# Altium schematic sheet DDR3.SchDoc: DDR3 memory
size 420 x 297 mm; CheckedBy: T.Janicki; CompanyName: Creotech Instruments SA; DrawnBy: G.Kasprowicz; Organization: CERN; Address1: European Organization for Nuclear Research; Address2: CH-1211 Genève 23 - Switzerland; Revision: -; SheetNumber: 3; SheetTotal: 19; EDA_Number: EDA-xxxx; Projet: Simple VME FMC Carrier; ModifiedBy: -; CreateDate: 20/11/2012; CheckedDate: 23/01/2012; Title2: - bank 4 -; DivGrp: BE-CO; Designer: G.Kasprowicz; PageSetup: Record=PageOptions|CenterHorizontal=True|CenterVertical=True|PrintScale=0.95|XCorrection=1.00|YCorrection=1.00|PrintKind=1|BorderSize=5000000|LeftOffset=0|BottomOffset=0|Orientation=2|PaperLength=1000|PaperWidth=1000|Scale=100|PaperSource=15|PrintQuality=600|MediaType=1|DitherType=10|PaperKind=A3|PrintScaleMode=1; ModifiedDate: -
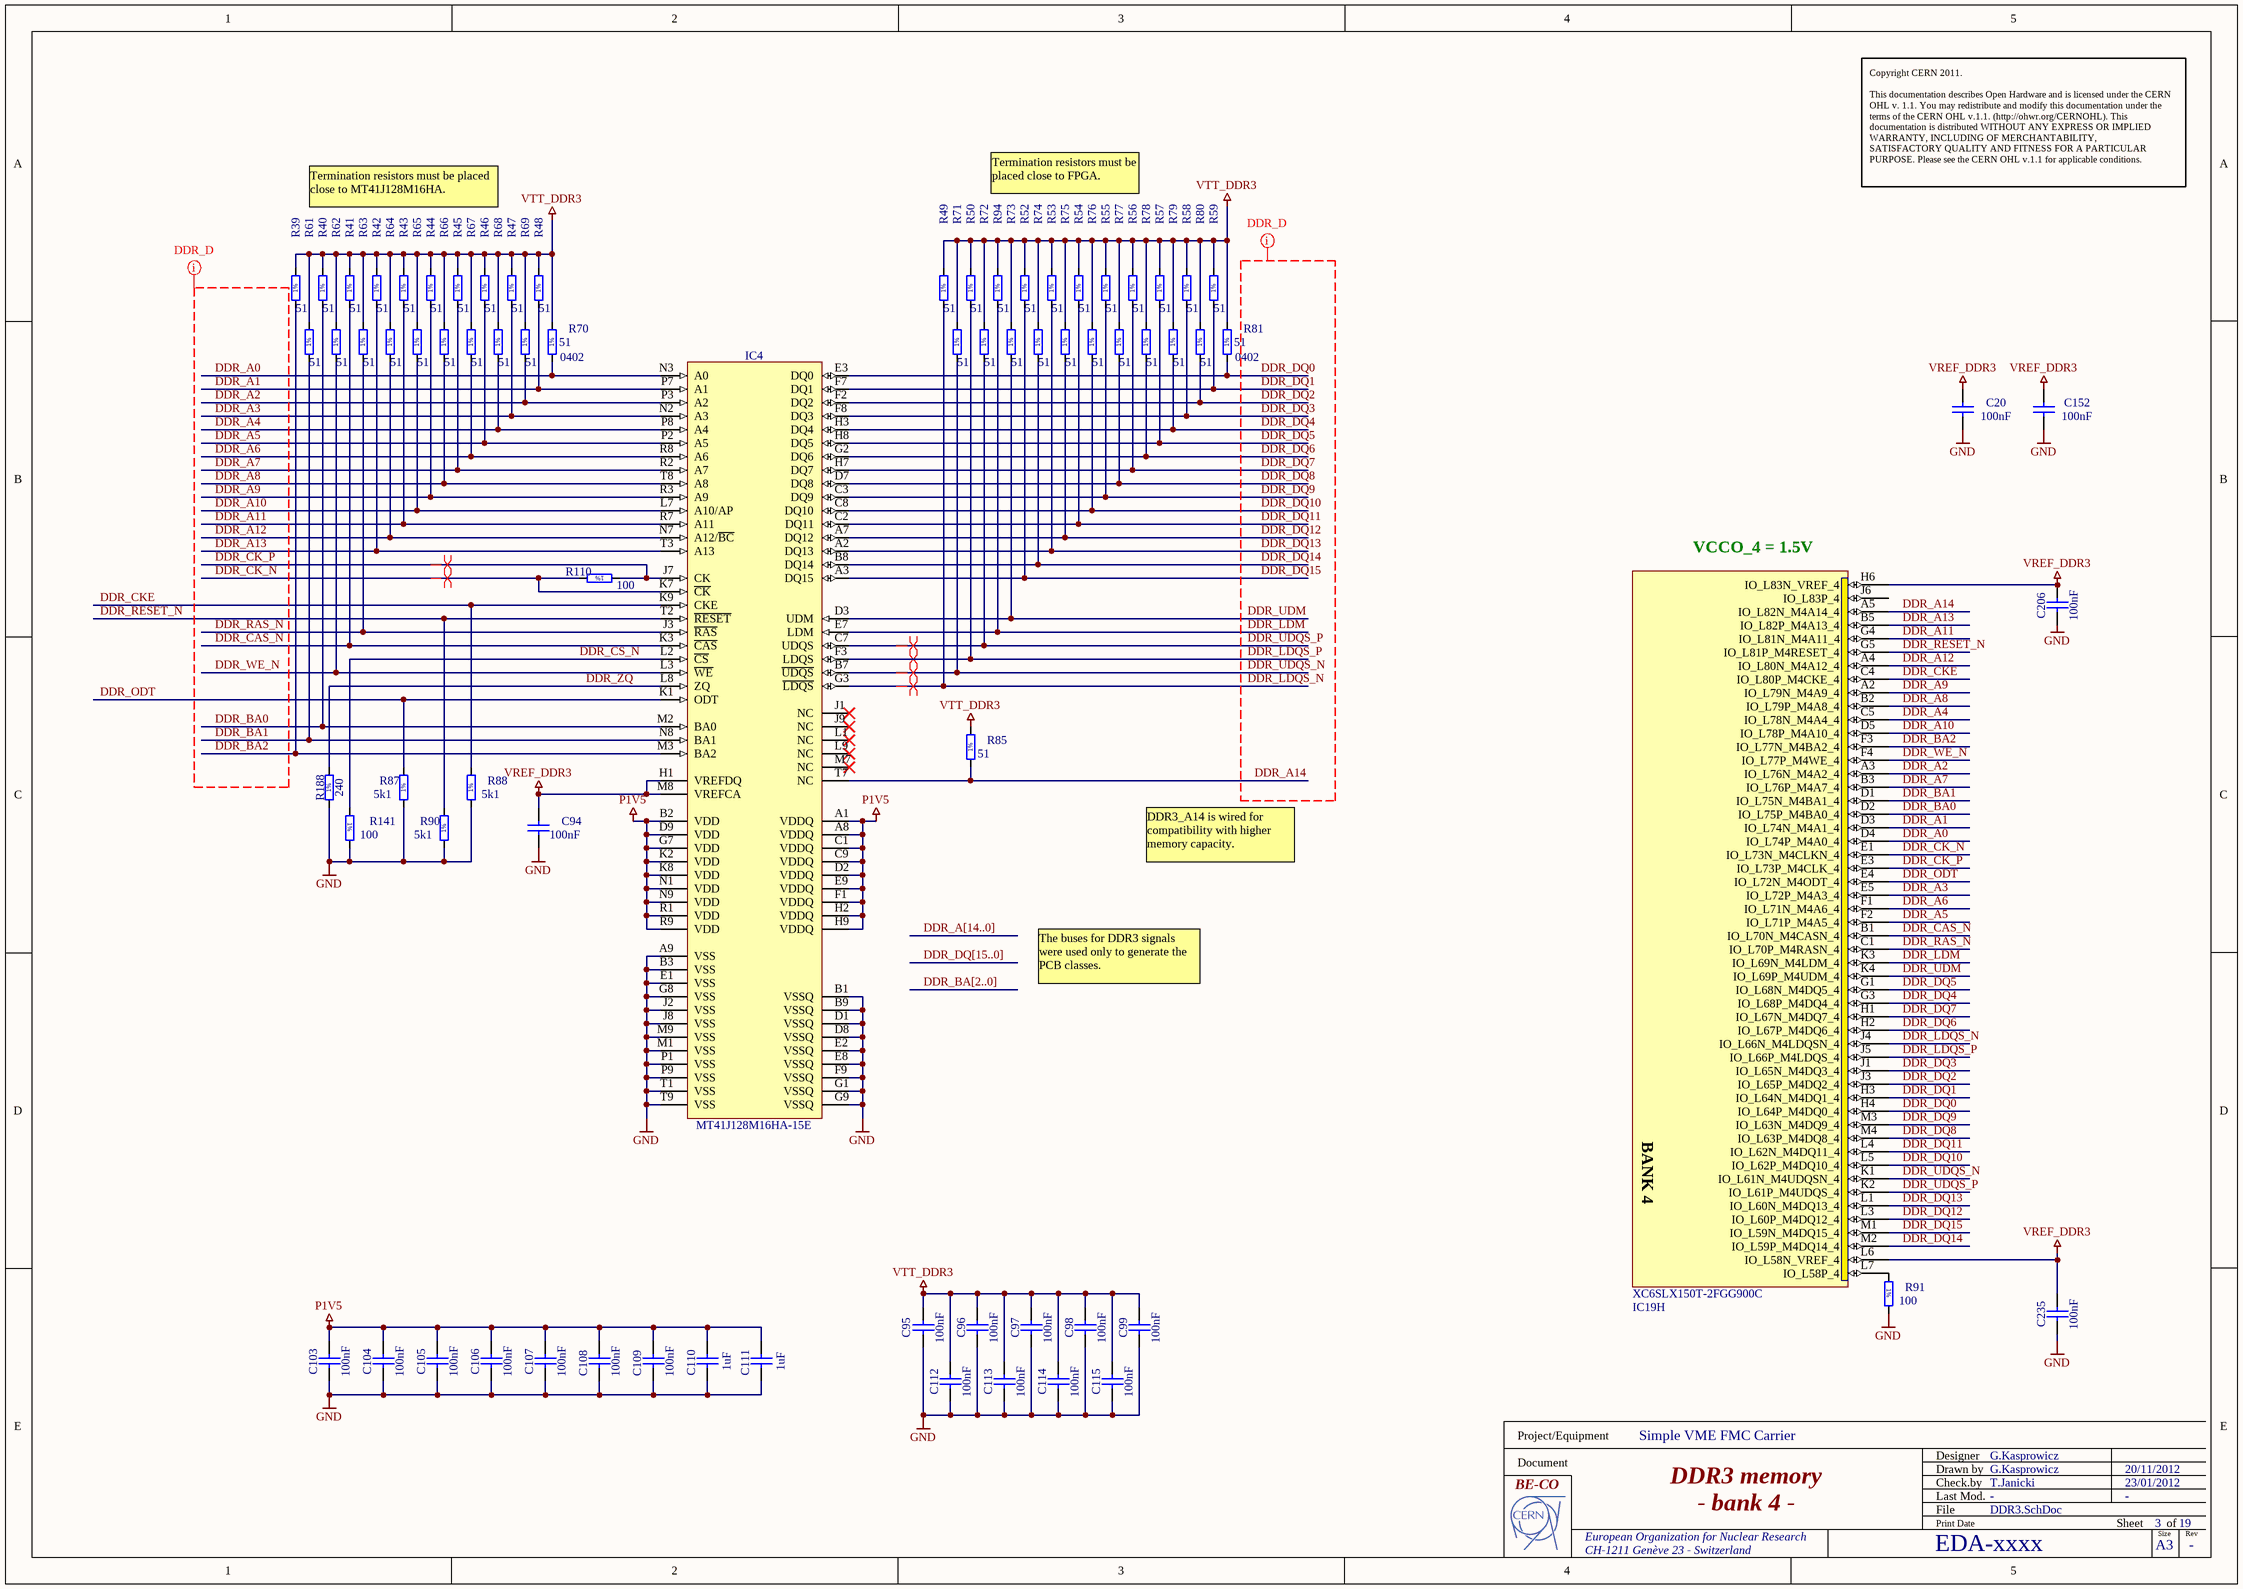
[diagram p0: DDR3.SchDoc]

## Parts
C20  100nF  [CAPC1005X55N]
C94  100nF  [CAPC1005X55N]
C95  100nF  [CAPC1005X55N]
C96  100nF  [CAPC1005X55N]
C97  100nF  [CAPC1005X55N]
C98  100nF  [CAPC1005X55N]
C99  100nF  [CAPC1005X55N]
C103  100nF  [CAPC1005X55N]
C104  100nF  [CAPC1005X55N]
C105  100nF  [CAPC1005X55N]
C106  100nF  [CAPC1005X55N]
C107  100nF  [CAPC1005X55N]
C108  100nF  [CAPC1005X55N]
C109  100nF  [CAPC1005X55N]
C110  1uF  [CAPC1608X87N]
C111  1uF  [CAPC1608X87N]
C112  100nF  [CAPC1005X55N]
C113  100nF  [CAPC1005X55N]
C114  100nF  [CAPC1005X55N]
C115  100nF  [CAPC1005X55N]
C152  100nF  [CAPC1005X55N]
C206  100nF  [CAPC1005X55N]
C235  100nF  [CAPC1005X55N]
IC4  MT41J128M16HA-15E  [BGA96C80P9X16_900X1400X120]
IC19  XC6SLX150T-2FGG900C  [BGA900C100P30X30_3100X3100X260]  (part H of 18)
R39  51  [RESC1005X40N]
R40  51  [RESC1005X40N]
R41  51  [RESC1005X40N]
R42  51  [RESC1005X40N]
R43  51  [RESC1005X40N]
R44  51  [RESC1005X40N]
R45  51  [RESC1005X40N]
R46  51  [RESC1005X40N]
R47  51  [RESC1005X40N]
R48  51  [RESC1005X40N]
R49  51  [RESC1005X40N]
R50  51  [RESC1005X40N]
R52  51  [RESC1005X40N]
R53  51  [RESC1005X40N]
R54  51  [RESC1005X40N]
R55  51  [RESC1005X40N]
R56  51  [RESC1005X40N]
R57  51  [RESC1005X40N]
R58  51  [RESC1005X40N]
R59  51  [RESC1005X40N]
R61  51  [RESC1005X40N]
R62  51  [RESC1005X40N]
R63  51  [RESC1005X40N]
R64  51  [RESC1005X40N]
R65  51  [RESC1005X40N]
R66  51  [RESC1005X40N]
R67  51  [RESC1005X40N]
R68  51  [RESC1005X40N]
R69  51  [RESC1005X40N]
R70  51  Case: 0402  [RESC1005X40N]
R71  51  [RESC1005X40N]
R72  51  [RESC1005X40N]
R73  51  [RESC1005X40N]
R74  51  [RESC1005X40N]
R75  51  [RESC1005X40N]
R76  51  [RESC1005X40N]
R77  51  [RESC1005X40N]
R78  51  [RESC1005X40N]
R79  51  [RESC1005X40N]
R80  51  [RESC1005X40N]
R81  51  Case: 0402  [RESC1005X40N]
R85  51  [RESC1005X40N]
R87  5k1  [RESC1608X55N]
R88  5k1  [RESC1608X55N]
R90  5k1  [RESC1608X55N]
R91  100  [RESC1608X55N]
R94  51  [RESC1005X40N]
R110  100  [RESC1608X55N]
R141  100  [RESC1608X55N]
R188  240  [RESC1608X55N]

## Nets
GND: C20.1 C94.1 C95.1 C96.1 C97.1 C98.1 C99.1 C103.1 C104.1 C105.1 C106.1 C107.1 C108.1 C109.1 C110.1 C111.1 C112.1 C113.1 C114.1 C115.1 C152.1 C206.1 C235.1 IC4.A9(VSS) IC4.B1(VSSQ) IC4.B3(VSS) IC4.B9(VSSQ) IC4.D1(VSSQ) IC4.D8(VSSQ) IC4.E1(VSS) IC4.E2(VSSQ) IC4.E8(VSSQ) IC4.F9(VSSQ) IC4.G1(VSSQ) IC4.G8(VSS) IC4.G9(VSSQ) IC4.J2(VSS) IC4.J8(VSS) IC4.M1(VSS) IC4.M9(VSS) IC4.P1(VSS) IC4.P9(VSS) IC4.T1(VSS) IC4.T9(VSS) R87.1 R88.1 R90.1 R91.2 R141.2 R188.1
P1V5: C103.2 C104.2 C105.2 C106.2 C107.2 C108.2 C109.2 C110.2 C111.2 IC4.A1(VDDQ) IC4.A8(VDDQ) IC4.B2(VDD) IC4.C1(VDDQ) IC4.C9(VDDQ) IC4.D2(VDDQ) IC4.D9(VDD) IC4.E9(VDDQ) IC4.F1(VDDQ) IC4.G7(VDD) IC4.H2(VDDQ) IC4.H9(VDDQ) IC4.K2(VDD) IC4.K8(VDD) IC4.N1(VDD) IC4.N9(VDD) IC4.R1(VDD) IC4.R9(VDD)
VREF_DDR3: C20.2 C94.2 C152.2 C206.2 C235.2 IC4.H1(VREFDQ) IC4.M8(VREFCA) IC19.H6(IO_L83N_VREF_4) IC19.L6(IO_L58N_VREF_4)
VTT_DDR3: C95.2 C96.2 C97.2 C98.2 C99.2 C112.2 C113.2 C114.2 C115.2 R39.2 R40.2 R41.2 R42.2 R43.2 R44.2 R45.2 R46.2 R47.2 R48.2 R49.2 R50.2 R52.2 R53.2 R54.2 R55.2 R56.2 R57.2 R58.2 R59.2 R61.2 R62.2 R63.2 R64.2 R65.2 R66.2 R67.2 R68.2 R69.2 R70.2 R71.2 R72.2 R73.2 R74.2 R75.2 R76.2 R77.2 R78.2 R79.2 R80.2 R81.2 R85.2 R94.2
DDR_A0: IC4.N3(A0) IC19.D4(IO_L74P_M4A0_4) R70.1
DDR_A1: IC4.P7(A1) IC19.D3(IO_L74N_M4A1_4) R48.1
DDR_A2: IC4.P3(A2) IC19.A3(IO_L76N_M4A2_4) R69.1
DDR_A3: IC4.N2(A3) IC19.E5(IO_L72P_M4A3_4) R47.1
DDR_A4: IC4.P8(A4) IC19.C5(IO_L78N_M4A4_4) R68.1
DDR_A5: IC4.P2(A5) IC19.F2(IO_L71P_M4A5_4) R46.1
DDR_A6: IC4.R8(A6) IC19.F1(IO_L71N_M4A6_4) R67.1
DDR_A7: IC4.R2(A7) IC19.B3(IO_L76P_M4A7_4) R45.1
DDR_A8: IC4.T8(A8) IC19.B2(IO_L79P_M4A8_4) R66.1
DDR_A9: IC4.R3(A9) IC19.A2(IO_L79N_M4A9_4) R44.1
DDR_A10: IC4.L7(A10/AP) IC19.D5(IO_L78P_M4A10_4) R65.1
DDR_A11: IC4.R7(A11) IC19.G4(IO_L81N_M4A11_4) R43.1
DDR_A12: IC4.N7(A12/~{BC}) IC19.A4(IO_L80N_M4A12_4) R64.1
DDR_A13: IC4.T3(A13) IC19.B5(IO_L82P_M4A13_4) R42.1
DDR_A14: IC4.T7(NC) IC19.A5(IO_L82N_M4A14_4) R85.1
DDR_BA0: IC4.M2(BA0) IC19.D2(IO_L75P_M4BA0_4) R40.1
DDR_BA1: IC4.N8(BA1) IC19.D1(IO_L75N_M4BA1_4) R61.1
DDR_BA2: IC4.M3(BA2) IC19.F3(IO_L77N_M4BA2_4) R39.1
DDR_CAS_N: IC4.K3(~{CAS}) IC19.B1(IO_L70N_M4CASN_4) R41.1
DDR_CK_N: IC4.K7(~{CK}) IC19.E1(IO_L73N_M4CLKN_4) R110.2
DDR_CK_P: IC4.J7(CK) IC19.E3(IO_L73P_M4CLK_4) R110.1
DDR_CKE: IC4.K9(CKE) IC19.C4(IO_L80P_M4CKE_4) R88.2
DDR_CS_N: IC4.L2(~{CS}) R141.1
DDR_DQ0: IC4.E3(DQ0) IC19.H4(IO_L64P_M4DQ0_4) R81.1
DDR_DQ1: IC4.F7(DQ1) IC19.H3(IO_L64N_M4DQ1_4) R59.1
DDR_DQ2: IC4.F2(DQ2) IC19.J3(IO_L65P_M4DQ2_4) R80.1
DDR_DQ3: IC4.F8(DQ3) IC19.J1(IO_L65N_M4DQ3_4) R58.1
DDR_DQ4: IC4.H3(DQ4) IC19.G3(IO_L68P_M4DQ4_4) R79.1
DDR_DQ5: IC4.H8(DQ5) IC19.G1(IO_L68N_M4DQ5_4) R57.1
DDR_DQ6: IC4.G2(DQ6) IC19.H2(IO_L67P_M4DQ6_4) R78.1
DDR_DQ7: IC4.H7(DQ7) IC19.H1(IO_L67N_M4DQ7_4) R56.1
DDR_DQ8: IC4.D7(DQ8) IC19.M4(IO_L63P_M4DQ8_4) R77.1
DDR_DQ9: IC4.C3(DQ9) IC19.M3(IO_L63N_M4DQ9_4) R55.1
DDR_DQ10: IC4.C8(DQ10) IC19.L5(IO_L62P_M4DQ10_4) R76.1
DDR_DQ11: IC4.C2(DQ11) IC19.L4(IO_L62N_M4DQ11_4) R54.1
DDR_DQ12: IC4.A7(DQ12) IC19.L3(IO_L60P_M4DQ12_4) R75.1
DDR_DQ13: IC4.A2(DQ13) IC19.L1(IO_L60N_M4DQ13_4) R53.1
DDR_DQ14: IC4.B8(DQ14) IC19.M2(IO_L59P_M4DQ14_4) R74.1
DDR_DQ15: IC4.A3(DQ15) IC19.M1(IO_L59N_M4DQ15_4) R52.1
DDR_LDM: IC4.E7(LDM) IC19.K3(IO_L69N_M4LDM_4) R94.1
DDR_LDQS_N: IC4.G3(~{LDQS}) IC19.J4(IO_L66N_M4LDQSN_4) R49.1
DDR_LDQS_P: IC4.F3(LDQS) IC19.J5(IO_L66P_M4LDQS_4) R50.1
DDR_ODT: IC4.K1(ODT) IC19.E4(IO_L72N_M4ODT_4) R87.2
DDR_RAS_N: IC4.J3(~{RAS}) IC19.C1(IO_L70P_M4RASN_4) R63.1
DDR_RESET_N: IC4.T2(~{RESET}) IC19.G5(IO_L81P_M4RESET_4) R90.2
DDR_UDM: IC4.D3(UDM) IC19.K4(IO_L69P_M4UDM_4) R73.1
DDR_UDQS_N: IC4.B7(~{UDQS}) IC19.K1(IO_L61N_M4UDQSN_4) R71.1
DDR_UDQS_P: IC4.C7(UDQS) IC19.K2(IO_L61P_M4UDQS_4) R72.1
DDR_WE_N: IC4.L3(~{WE}) IC19.F4(IO_L77P_M4WE_4) R62.1
DDR_ZQ: IC4.L8(ZQ) R188.2
NetIC19_L7: IC19.L7(IO_L58P_4) R91.1

Not connected (* = marked no-connect by the designer): IC4 J1(NC)* J9(NC)* L1(NC)* L9(NC)* M7(NC)*; IC19 J6(IO_L83P_4)

## Buses and harness runs
bus DDR_A[14..0]
bus DDR_BA[2..0]
bus DDR_DQ[15..0]

## Layout directives
differential pair: DDR_CK_N, DDR_CK_P, DDR_LDQS_N, DDR_LDQS_P, DDR_UDQS_N, DDR_UDQS_P
net class DDR_D: DDR_A0, DDR_A1, DDR_A2, DDR_A3, DDR_A4, DDR_A5, DDR_A6, DDR_A7, DDR_A8, DDR_A9, DDR_A10, DDR_A11, DDR_A12, DDR_A13, DDR_A14, DDR_BA0, DDR_BA1, DDR_BA2, DDR_CAS_N, DDR_CK_N, DDR_CK_P, DDR_DQ0, DDR_DQ1, DDR_DQ2, DDR_DQ3, DDR_DQ4, DDR_DQ5, DDR_DQ6, DDR_DQ7, DDR_DQ8, DDR_DQ9, DDR_DQ10, DDR_DQ11, DDR_DQ12, DDR_DQ13, DDR_DQ14, DDR_DQ15, DDR_LDM, DDR_LDQS_N, DDR_LDQS_P, DDR_RAS_N, DDR_UDM, DDR_UDQS_N, DDR_UDQS_P, DDR_WE_N

## Notes on the sheet
- Termination resistors must be placed close to FPGA.
- Copyright CERN 2011.
  This documentation describes Open Hardware and is licensed under the CERN OHL v. 1.1. You may redistribute and modify this documentation under the terms of the CERN OHL v.1.1. (http://ohwr.org/CERNOHL). This documentation is distributed WITHOUT ANY EXPRESS OR IMPLIED WARRANTY, INCLUDING OF MERCHANTABILITY, SATISFACTORY QUALITY AND FITNESS FOR A PARTICULAR PURPOSE. Please see the CERN OHL v.1.1 for applicable conditions.
- Termination resistors must be placed close to MT41J128M16HA.
- (near IC19) VCCO_4 = 1.5V
- DDR3_A14 is wired for compatibility with higher memory capacity.
- The buses for DDR3 signals were used only to generate the PCB classes.
- Project/Equipment
- Document
- Designer
- Drawn by
- Check.by
- File
- Last Mod.
- Print Date
- Sheet
- Size
- A3
- of
- Rev
- (in symbol R0402_51R_1%_0.0625W_100PPM) 1%
- (in symbol R0603_5K1_1%_0.1W_100PPM) 1%
- (in symbol R0603_100R_1%_0.1W_100PPM) 1%
- (in symbol R0603_240R_1%_0.1W_100PPM) 1%
- (in symbol XC6SLX150T-2FGG900C, part H) BANK 4

## Library data of the parts
C20 C94-C99 C103-C107 C112-C115 C152 = CC0402_100NF_16V_10%_X7R: Non-polarised capacitor; Part Description: SMD Multilayer Chip Ceramic Capacitor; Manufacturer: GENERIC; Manufacturer1 Part Number: 223878715649; Manufacturer1 Datasheet: \\cern.ch\dfs\Applications\Altium\Datasheets\CC0402_X7R_PHYCOMP.pdf; Voltage: 16V; TC: X7R; Tolerance: ±10%; Table: Capacitors SMD; Part Number: CC0402_100NF_16V_10%_X7R; Component Kind: Standard; Component Type: Standard; Designator: Capacitor - non polarized; Library Reference: Capacitor - non polarized; Pin Count: 2; Value: 100nF; Status: Not Recommended; Manufacturer Part Number: CC0402_100NF_16V_10%_X7R; Case: 0402; Mounted: Yes; Socket: No; SMD: Yes; Manufacturer1 Example: PHYCOMP; Manufacturer1 ComponentHeight: 0.55mm; HelpURL: \\cern.ch\dfs\Applications\Altium\Datasheets\CC0402_X7R_PHYCOMP.pdf; Author: CERN DEM JLC; CreateDate: 12/3/2007; LatestRevisionDate: 12/3/2007
C108 C109 C206 C235 = CC0402_100NF_16V_10%_X7R: Non-polarised capacitor; Part Description: SMD Multilayer Chip Ceramic Capacitor; Manufacturer: GENERIC; Manufacturer1 Part Number: 223878715649; Voltage: 16V; TC: X7R; Tolerance: ±10%; Table: Capacitors SMD; Part Number: CC0402_100NF_16V_10%_X7R; Component Kind: Standard; Component Type: Standard; Pin Count: 2; Value: 100nF; Status: Not Recommended; Manufacturer Part Number: CC0402_100NF_16V_10%_X7R; Case: 0402; Mounted: Yes; Socket: No; SMD: Yes; Manufacturer1 Example: PHYCOMP; Manufacturer1 ComponentHeight: 0.55mm; HelpURL: \\cern.ch\dfs\Applications\Altium\Datasheets\CC0402_X7R_PHYCOMP.pdf; Author: CERN DEM JLC; CreateDate: 03/12/2007; LatestRevisionDate: 03/12/2007
C110 C111 = CC0603_1UF_16V_10%_X7R: Non-polarised capacitor; Part Description: SMD Multilayer Chip Ceramic Capacitor; Manufacturer: GENERIC; Manufacturer1 Part Number: 223824613663; Voltage: 16V; TC: X7R; Tolerance: ±10%; Table: Capacitors SMD; Part Number: CC0603_1UF_16V_10%_X7R; Component Kind: Standard; Component Type: Standard; Pin Count: 2; Value: 1uF; Status: Preferred; Manufacturer Part Number: CC0603_1uF_16V_10%_X7R; Case: 0603; Mounted: Yes; Socket: No; SMD: Yes; Manufacturer1 Example: PHYCOMP; Manufacturer1 ComponentHeight: 0.87mm; HelpURL: \\cern.ch\dfs\Applications\Altium\Datasheets\CC0805_X5R_PHYCOMP_HC.pdf; Author: CERN DEM JLC; CreateDate: 03/12/2007; LatestRevisionDate: 03/12/2007
IC4 = MT41J128M16HA-15E: 16 Meg x 16 x 8 Banks DDR3 SDRAM; Part Description: 16 Meg x 16 x 8 Banks DDR3 SDRAM, +1.5V Supply; Manufacturer: MICRON TECHNOLOGY; Table: Logic; Part Number: MT41J128M16HA-15E; Component Kind: Standard; Component Type: Standard; Designator: MT41J128M16HA; Device: MT41J128M16HA-15E; Library Reference: MT41J128M16HA; PackageDescription: BGA 0.8mm, Pitch, Square 96 Pin, 9 Columns x 16 Rows, Body 14mm X 9mm X 1.2mm H; Manufacturer Part Number: MT41J128M16HA-15E; Pin Count: 96; Case: BGA96; Mounted: Yes; Socket: No; SMD: Yes; ComponentHeight: 1.2mm; Datasheet: \\cern.ch\dfs\Applications\Altium\Datasheets\MT41J128M16HA-15E.pdf; HelpURL: \\cern.ch\dfs\Applications\Altium\Datasheets\MT41J128M16HA-15E.pdf; Author: CERN DEM JLC; CreateDate: 11/19/2009; LatestRevisionDate: 11/19/2009
IC19 = XC6SLX150T-2FGG900C: SPARTAN-6, FPGA, 900-Ball BGA, Commercial Grade, Pb-Free; Part Description: SPARTAN-6, FPGA, 540 User I/Os, 8 GTPs, 900-Ball BGA, Commercial Grade, Pb-Free; Manufacturer: XILINX; Table: Logic; Part Number: XC6SLX150T-2FGG900C; Component Kind: Standard; Component Type: Standard; Device: XC6SLX150T-2FGG900C; PackageDescription: BGA,1.00mm pitch, square; 900 pin, 30 columns X 30 rows, 31.00mm X 31.00mm X 2.60mm H, IPC Medium Density; Manufacturer Part Number: XC6SLX150T-2FGG900C; Pin Count: 900; Case: BGA900; Mounted: Yes; Socket: No; SMD: Yes; ComponentHeight: 2.6mm; HelpURL: \\cern.ch\dfs\Applications\Altium\Datasheets\XC6SLX150T-2FGG900C.pdf; ComponentLink1URL: \\cern.ch\dfs\Applications\Altium\Datasheets\XC6SLX150T-2FGG900C_Package-Pinouts.pdf; ComponentLink1Description: Package/Pinouts; Author: CERN DEM JLC; CreateDate: 2009-11-17; LatestRevisionDate: 2009-11-17
R39-R50 R52-R59 R61-R81 R85 R94 = R0402_51R_1%_0.0625W_100PPM: Resistor - 1%; Part Description: General Purpose Thick Film Chip Resistor; Manufacturer: GENERIC; Manufacturer1 Part Number: 232270675109; TC: ±100ppm/°C; Table: Resistors SMD; Part Number: R0402_51R_1%_0.0625W_100PPM; Component Kind: Standard; Component Type: Standard; Pin Count: 2; Value: 51; Status: Not recommended; Power: 0.0625W; Tolerance: ±1%; Manufacturer Part Number: R0402_51R_1%_0.0625W_100PPM; Mounted: Yes; Socket: No; SMD: Yes; Manufacturer1 Example: PHYCOMP; Manufacturer1 ComponentHeight: 0.4mm; HelpURL: \\cern.ch\dfs\Applications\Altium\Datasheets\R0402_Phycomp_RC0402.pdf; Author: CERN DEM JLC; CreateDate: 03/12/2007; LatestRevisionDate: 13/03/2008
  R39-R50 R52-R59 R61-R69 R71-R80 R85 R94: Case: 0402
R87 R88 R90 = R0603_5K1_1%_0.1W_100PPM: Resistor - 1%; Part Description: General Purpose Thick Film Chip Resistor; Manufacturer: GENERIC; Manufacturer1 Part Number: NRC06F5101TRF; Power: 0.1W; TC: ±100ppm/°C; Table: Resistors SMD; Part Number: R0603_5K1_1%_0.1W_100PPM; Component Kind: Standard; Component Type: Standard; Pin Count: 2; Value: 5k1; Status: Preferred; Tolerance: ±1%; Manufacturer Part Number: R0603_5K1_1%_0.1W_100PPM; Case: 0603; Mounted: Yes; Socket: No; SMD: Yes; Manufacturer1 Example: NIC COMPONENT; Manufacturer1 ComponentHeight: 0.55mm; HelpURL: \\cern.ch\dfs\Applications\Altium\Datasheets\R0603_NIC_NRC.pdf; Author: CERN DEM JLC; CreateDate: 03/12/2007; LatestRevisionDate: 13/03/2008
R91 R110 R141 = R0603_100R_1%_0.1W_100PPM: Resistor - 1%; Part Description: General Purpose Thick Film Chip Resistor; Manufacturer: GENERIC; Manufacturer1 Part Number: NRC06F4700TRF; Power: 0.1W; TC: ±100ppm/°C; Table: Resistors SMD; Part Number: R0603_100R_1%_0.1W_100PPM; Component Kind: Standard; Component Type: Standard; Pin Count: 2; Value: 100; Status: Preferred; Tolerance: ±1%; Manufacturer Part Number: R0603_100R_1%_0.1W_100PPM; Case: 0603; Mounted: Yes; Socket: No; SMD: Yes; Manufacturer1 Example: NIC COMPONENT; Manufacturer1 ComponentHeight: 0.55mm; HelpURL: \\cern.ch\dfs\Applications\Altium\Datasheets\R0603_NIC_NRC.pdf; Author: CERN DEM JLC; CreateDate: 2007-12-03; LatestRevisionDate: 2008-03-13
R188 = R0603_240R_1%_0.1W_100PPM: Resistor - 1%; Part Description: General Purpose Thick Film Chip Resistor; Manufacturer: GENERIC; Manufacturer1 Part Number: NRC06F2400TRF; Power: 0.1W; TC: ±100ppm/°C; Table: Resistors SMD; Part Number: R0603_240R_1%_0.1W_100PPM; Component Kind: Standard; Component Type: Standard; Pin Count: 2; Value: 240; Status: Preferred; Tolerance: ±1%; Manufacturer Part Number: R0603_240R_1%_0.1W_100PPM; Case: 0603; Mounted: Yes; Socket: No; SMD: Yes; Manufacturer1 Example: NIC COMPONENT; Manufacturer1 ComponentHeight: 0.55mm; HelpURL: \\cern.ch\dfs\Applications\Altium\Datasheets\R0603_NIC_NRC.pdf; Author: CERN DEM JLC; CreateDate: 12/3/2007; LatestRevisionDate: 3/13/2008